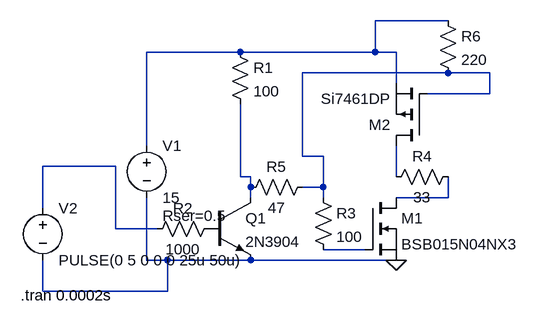
[diagram p0: schematic GateDriverProto_1.asc]
GateDriverProto_1.asc, the LTspice schematic file:
Version 4
SHEET 1 880 680
WIRE 256 -192 144 -192
WIRE -64 -144 -208 -144
WIRE 144 -144 144 -192
WIRE 144 -144 -64 -144
WIRE 176 -144 144 -144
WIRE 256 -112 32 -112
WIRE 320 -112 256 -112
WIRE 176 -96 176 -144
WIRE 320 -80 320 -112
WIRE 320 -80 224 -80
WIRE -208 0 -208 -144
WIRE 32 16 32 -112
WIRE 64 16 32 16
WIRE -256 32 -368 32
WIRE -64 48 -64 -64
WIRE -48 48 -64 48
WIRE 176 48 176 0
WIRE -48 64 -48 48
WIRE 64 64 64 16
WIRE 64 64 32 64
WIRE -48 80 -48 64
WIRE 64 80 64 64
WIRE 256 80 256 48
WIRE 256 80 176 80
WIRE -368 96 -368 32
WIRE -256 128 -256 32
WIRE -192 128 -256 128
WIRE 128 160 64 160
WIRE -208 176 -208 80
WIRE -176 176 -208 176
WIRE -48 176 -176 176
WIRE 176 176 -48 176
WIRE -368 224 -368 176
WIRE -176 224 -176 176
WIRE -176 224 -368 224
FLAG 176 176 0
SYMBOL nmos 128 80 R0
SYMATTR InstName M1
SYMATTR Value BSB015N04NX3
SYMBOL voltage -208 -16 R0
WINDOW 123 0 0 Left 0
WINDOW 39 24 124 Left 2
SYMATTR InstName V1
SYMATTR Value 15
SYMATTR SpiceLine Rser=0.5
SYMBOL npn -112 80 R0
SYMATTR InstName Q1
SYMATTR Value 2N3904
SYMBOL res -80 -160 R0
SYMATTR InstName R1
SYMATTR Value 100
SYMATTR SpiceLine tol=5 pwr=0.25
SYMBOL res -96 112 R90
WINDOW 0 0 56 VBottom 2
WINDOW 3 32 56 VTop 2
SYMATTR InstName R2
SYMATTR Value 1000
SYMATTR SpiceLine tol=5 pwr=0.25
SYMBOL voltage -368 80 R0
WINDOW 123 0 0 Left 0
WINDOW 39 0 0 Left 0
SYMATTR InstName V2
SYMATTR Value PULSE(0 5 0 0 0 25u 50u)
SYMBOL pmos 224 0 R180
SYMATTR InstName M2
SYMATTR Value Si7461DP
SYMBOL res 272 32 R90
WINDOW 0 0 56 VBottom 2
WINDOW 3 32 56 VTop 2
SYMATTR InstName R4
SYMATTR Value 33
SYMBOL res 48 64 R0
SYMATTR InstName R3
SYMATTR Value 100
SYMBOL res 48 48 R90
WINDOW 0 0 56 VBottom 2
WINDOW 3 32 56 VTop 2
SYMATTR InstName R5
SYMATTR Value 47
SYMBOL res 240 -208 R0
SYMATTR InstName R6
SYMATTR Value 220
TEXT -402 230 Left 2 !.tran 0.0002s

The netlist it stands for:
* GateDriverProto_1.asc
M1 N006 N007 0 0 BSB015N04NX3
V1 N001 0 15 Rser=0.5
Q1 N004 P001 0 0 2N3904
R1 N001 N004 100 tol=5 pwr=0.25
R2 P001 N003 1000 tol=5 pwr=0.25
V2 N003 0 PULSE(0 5 0 0 0 25u 50u)
M2 N005 N002 N001 N001 Si7461DP
R4 N006 N005 33
R3 N002 N007 100
R5 N002 N004 47
R6 N001 N002 220
.model NPN NPN
.model PNP PNP
.lib standard.bjt
.model NMOS NMOS
.model PMOS PMOS
.lib standard.mos
.tran 0.0002s
.backanno
.end